# Altium schematic sheet leddriver.SchDoc
size A4; SheetNumber: 4; SheetTotal: 5
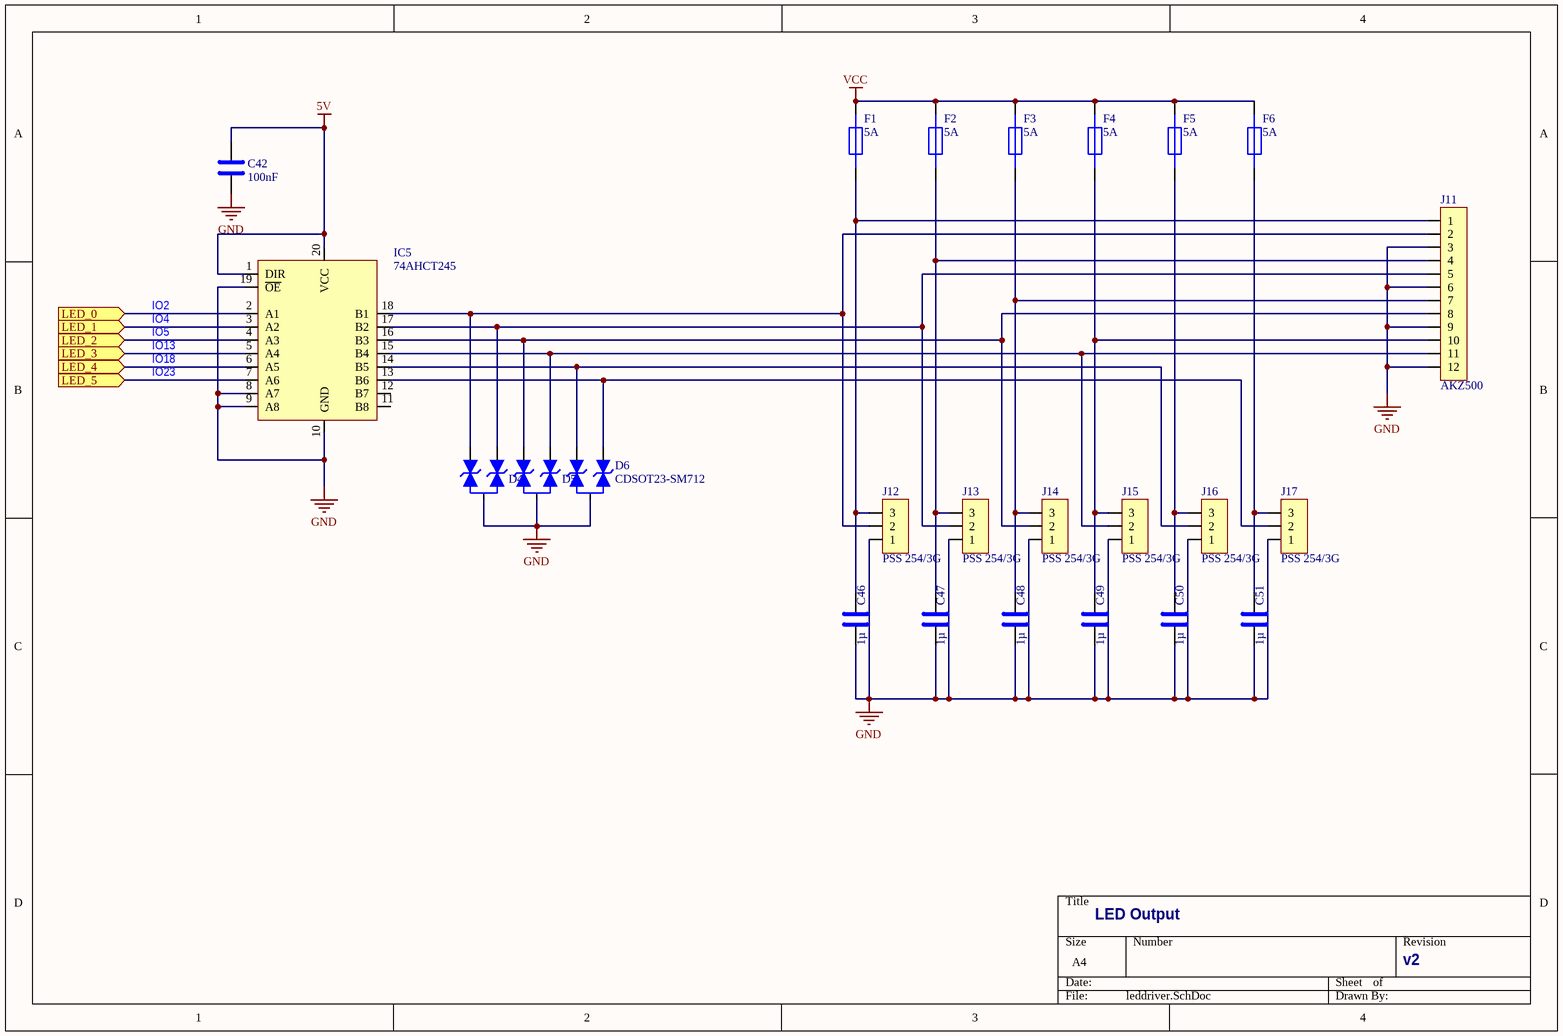
[diagram p0: leddriver.SchDoc]

## Parts
C42  value 100nF  [0603]  (hidden comment: 100nF 50V MLCC 0603)
C46  value 1µ  [1206]  (hidden comment: 1µF 50V MLCC 1206)
C47  value 1µ  [1206]  (hidden comment: 1µF 50V MLCC 1206)
C48  value 1µ  [1206]  (hidden comment: 1µF 50V MLCC 1206)
C49  value 1µ  [1206]  (hidden comment: 1µF 50V MLCC 1206)
C50  value 1µ  [1206]  (hidden comment: 1µF 50V MLCC 1206)
C51  value 1µ  [1206]  (hidden comment: 1µF 50V MLCC 1206)
D4  CDSOT23-SM712  [SOT23]  (value not drawn)
D5  CDSOT23-SM712  [SOT23]  (value not drawn)
D6  CDSOT23-SM712  [SOT23]
F1  5A  [1206]
F2  5A  [1206]
F3  5A  [1206]
F4  5A  [1206]
F5  5A  [1206]
F6  5A  [1206]
IC5  74AHCT245  [TSSOP20]
J11  AKZ500  [AKZ500/12]
J12  PSS 254/3G  [PSS 3pol]
J13  PSS 254/3G  [PSS 3pol]
J14  PSS 254/3G  [PSS 3pol]
J15  PSS 254/3G  [PSS 3pol]
J16  PSS 254/3G  [PSS 3pol]
J17  PSS 254/3G  [PSS 3pol]

## Ports
LED_0 (in), LED_1 (in), LED_2 (in), LED_3 (in), LED_4 (in), LED_5 (in)

## Nets
5V: C42.1 IC5.1(DIR) IC5.20(VCC)
GND: C42.2 C46.2 C47.2 C48.2 C49.2 C50.2 C51.2 D4.3 D5.3 D6.3 IC5.8(A7) IC5.9(A8) IC5.10(GND) IC5.19(~{OE}) J11.3 J11.6 J11.9 J11.12 J12.1 J13.1 J14.1 J15.1 J16.1 J17.1
VCC: F1.2 F2.2 F3.2 F4.2 F5.2 F6.2
LED_0: IC5.2(A1) ; port LED_0
LED_1: IC5.3(A2) ; port LED_1
LED_2: IC5.4(A3) ; port LED_2
LED_3: IC5.5(A4) ; port LED_3
LED_4: IC5.6(A5) ; port LED_4
LED_5: IC5.7(A6) ; port LED_5
NetC46_1: C46.1 F1.1 J11.1 J12.3
NetC47_1: C47.1 F2.1 J11.4 J13.3
NetC48_1: C48.1 F3.1 J11.7 J14.3
NetC49_1: C49.1 F4.1 J11.10 J15.3
NetC50_1: C50.1 F5.1 J16.3
NetC51_1: C51.1 F6.1 J17.3
NetD4_1: D4.1 IC5.18(B1) J11.2 J12.2
NetD4_2: D4.2 IC5.17(B2) J11.5 J13.2
NetD5_1: D5.1 IC5.16(B3) J11.8 J14.2
NetD5_2: D5.2 IC5.15(B4) J11.11 J15.2
NetD6_1: D6.1 IC5.14(B5) J16.2
NetD6_2: D6.2 IC5.13(B6) J17.2

Not connected (* = marked no-connect by the designer): IC5 11(B8) 12(B7)

## Notes on the sheet
- IO2
- IO4
- IO5
- IO13
- IO18
- IO23
- LED Output
- v2

## Library data of the parts
C42 = 100nF 50V MLCC 0603: Reichelt code: X7R-G0603 100N; dielectricum: X7R; voltage: 50V; mouser code: 80-C0603X104K3R; storage: AIDTEKBox | Röhrchen; storageID: 18 | F7; lcsc code: C2252264
C46-C51 = 1µF 50V MLCC 1206: dielectricum: X7R; mouser code: 810-C3216X7R1H105K; voltage: 50V
D4-D6 = CDSOT23-SM712: Dual TVS diode; mouser code: 652-CDSOT23-SM712
F1-F6 = Fuse_1206_5A: Fuse, 1206, 5A, 63V; mouser code: 530-C1T5
IC5 = SN74AHCT245: Octal Tristate Bus driver; mouser code: 595-SN74AHCT245PWRE4; storage: AIDETEK; storageID: 193
J11 = AKZ500/12: mouser code: 845-34.112
J12-J17 = PSS 254/3G: PSS 3pol wire-to-board-connector; reichelt code: PSS 254/3G